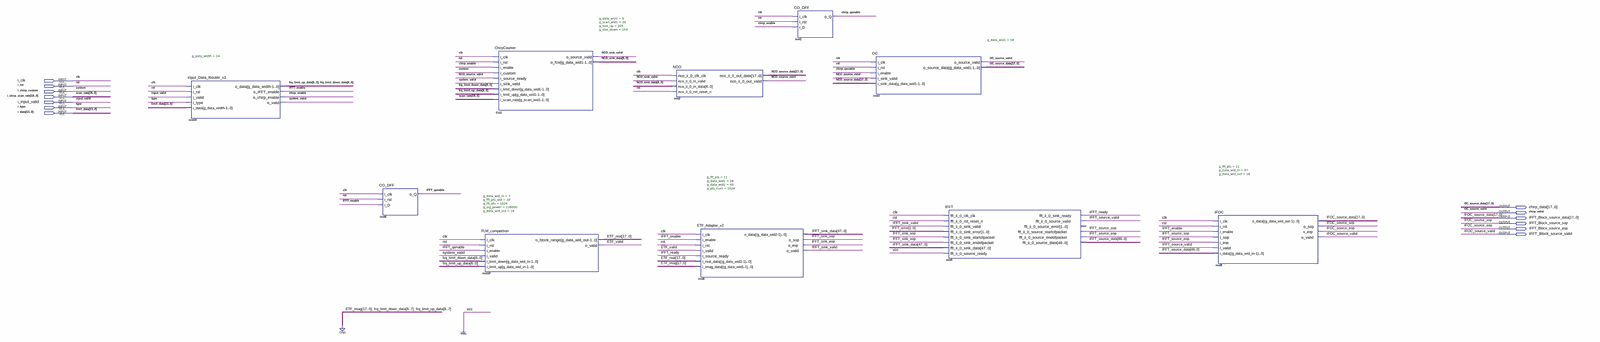
[diagram p0: schematic sheet, whole]
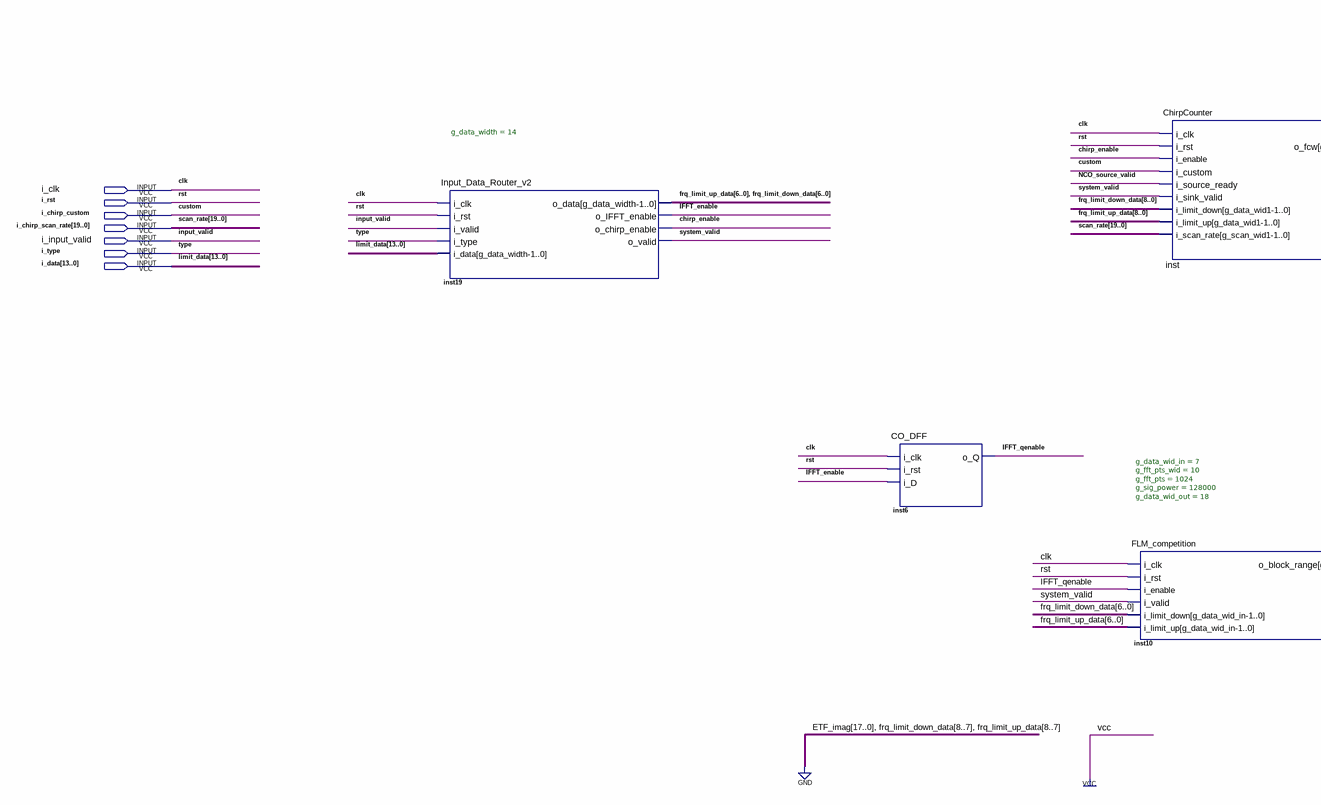
[diagram p1: schematic sheet, left part]
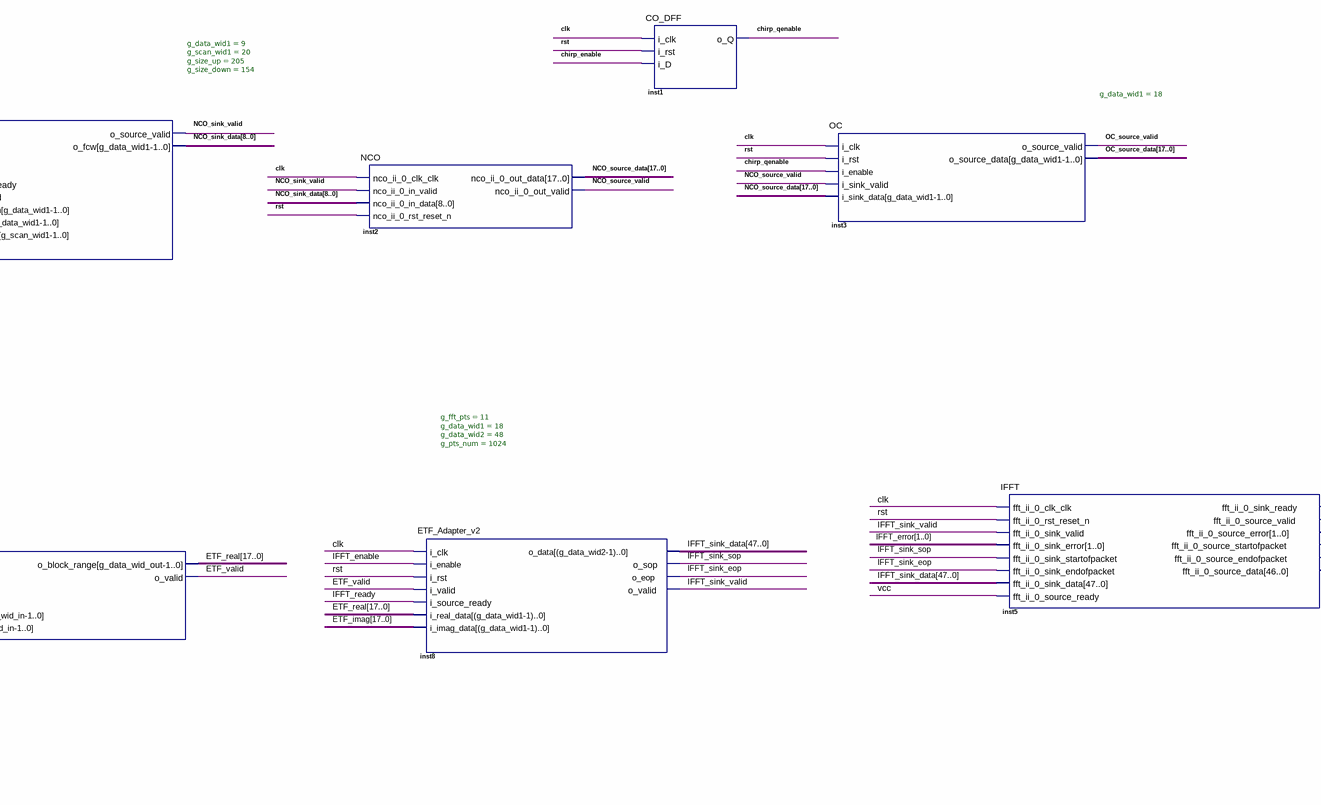
[diagram p2: schematic sheet, centre part]
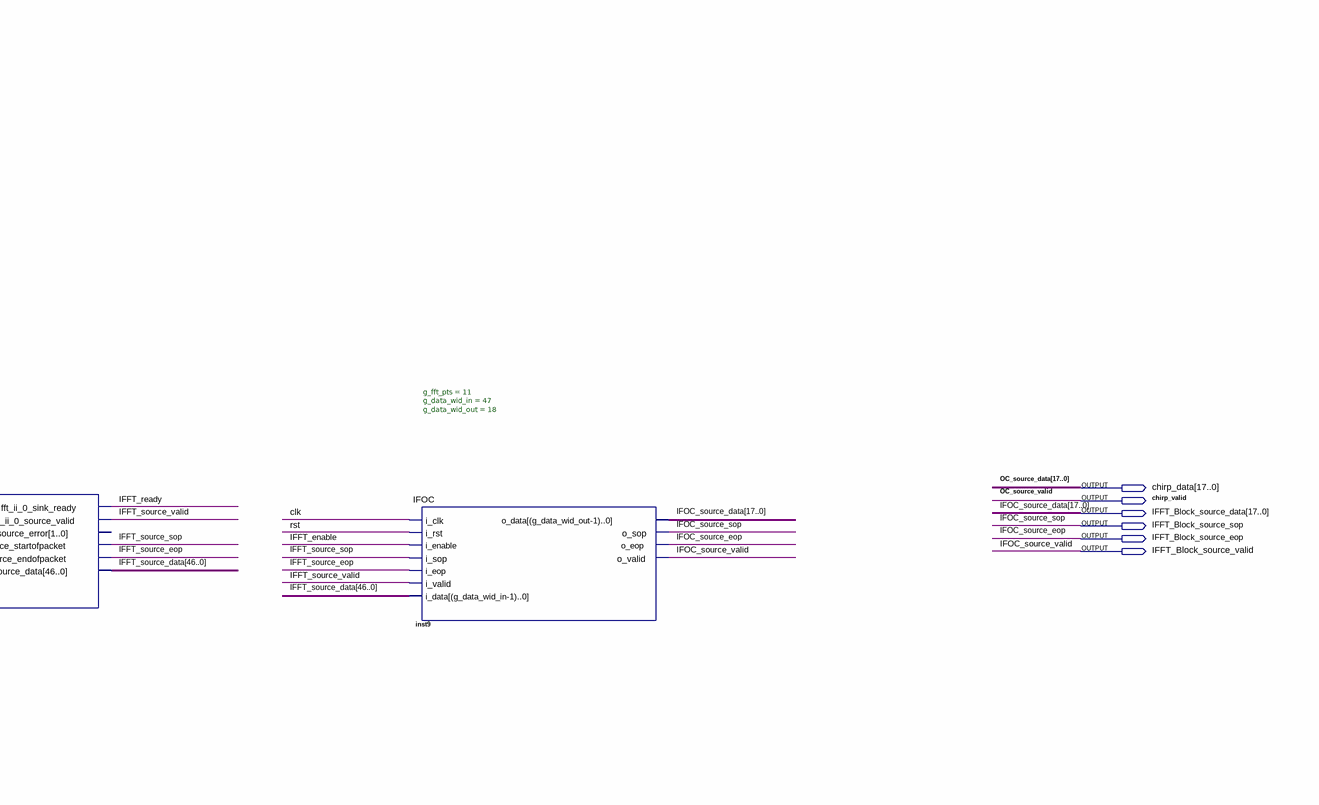
[diagram p3: schematic sheet, right part]
// Quartus schematic IFFT_Chirp_Test.bdf as structural Verilog: 10 symbols, 13 pins
module IFFT_Chirp_Test (
  input  i_clk,
  input  i_rst,
  input  i_chirp_custom,
  input  [19:0] i_chirp_scan_rate,
  input  i_input_valid,
  input  i_type,
  input  [13:0] i_data,
  output [17:0] chirp_data,
  output chirp_valid,
  output [17:0] IFFT_Block_source_data,
  output IFFT_Block_source_sop,
  output IFFT_Block_source_eop,
  output IFFT_Block_source_valid
);

  wire chirp_enable, chirp_qenable, ETF_valid, IFFT_enable, IFFT_qenable, IFFT_ready, IFFT_sink_eop,
       IFFT_sink_sop, IFFT_sink_valid, IFFT_source_eop, IFFT_source_sop, IFFT_source_valid, NCO_sink_valid,
       NCO_source_valid, system_valid;
  wire [1:0] IFFT_error;
  wire [6:0] frq_limit_down_data, frq_limit_up_data;
  wire [8:0] NCO_sink_data;
  wire [17:0] ETF_real, NCO_source_data;
  wire [46:0] IFFT_source_data;
  wire [47:0] IFFT_sink_data;

  Input_Data_Router_v2 #(.g_data_width(14)) inst19 (
    .i_clk(i_clk), .i_rst(i_rst), .i_valid(i_input_valid), .i_type(i_type), .i_data(i_data),
    .o_data({frq_limit_up_data, frq_limit_down_data}), .o_IFFT_enable(IFFT_enable),
    .o_chirp_enable(chirp_enable), .o_valid(system_valid));
  CO_DFF inst6 (.i_clk(i_clk), .i_rst(i_rst), .i_D(IFFT_enable), .o_Q(IFFT_qenable));
  ChirpCounter #(.g_data_wid1(9), .g_scan_wid1(20), .g_size_up(205), .g_size_down(154)) inst (
    .i_clk(i_clk), .i_rst(i_rst), .i_enable(chirp_enable), .i_custom(i_chirp_custom),
    .i_source_ready(NCO_source_valid), .i_sink_valid(system_valid),
    .i_limit_down({2'b00, frq_limit_down_data}), .i_limit_up({2'b00, frq_limit_up_data}),
    .i_scan_rate(i_chirp_scan_rate), .o_source_valid(NCO_sink_valid), .o_fcw(NCO_sink_data));
  FLM_competition #(.g_data_wid_in(7), .g_fft_pts_wid(10), .g_fft_pts(1024), .g_sig_power(128000), .g_data_wid_out(18)) inst10 (
    .i_clk(i_clk), .i_rst(i_rst), .i_enable(IFFT_qenable), .i_valid(system_valid),
    .i_limit_down(frq_limit_down_data), .i_limit_up(frq_limit_up_data), .o_block_range(ETF_real),
    .o_valid(ETF_valid));
  NCO inst2 (
    .nco_ii_0_clk_clk(i_clk), .nco_ii_0_in_valid(NCO_sink_valid), .nco_ii_0_in_data(NCO_sink_data),
    .nco_ii_0_rst_reset_n(i_rst), .nco_ii_0_out_data(NCO_source_data), .nco_ii_0_out_valid(NCO_source_valid));
  ETF_Adapter_v2 #(.g_fft_pts(11), .g_data_wid1(18), .g_data_wid2(48), .g_pts_num(1024)) inst8 (
    .i_clk(i_clk), .i_enable(IFFT_enable), .i_rst(i_rst), .i_valid(ETF_valid), .i_source_ready(IFFT_ready),
    .i_real_data(ETF_real), .i_imag_data({18{1'b0}}), .o_data(IFFT_sink_data), .o_sop(IFFT_sink_sop),
    .o_eop(IFFT_sink_eop), .o_valid(IFFT_sink_valid));
  CO_DFF inst1 (.i_clk(i_clk), .i_rst(i_rst), .i_D(chirp_enable), .o_Q(chirp_qenable));
  OC #(.g_data_wid1(18)) inst3 (
    .i_clk(i_clk), .i_rst(i_rst), .i_enable(chirp_qenable), .i_sink_valid(NCO_source_valid),
    .i_sink_data(NCO_source_data), .o_source_valid(chirp_valid), .o_source_data(chirp_data));
  IFFT inst5 (
    .fft_ii_0_clk_clk(i_clk), .fft_ii_0_rst_reset_n(i_rst), .fft_ii_0_sink_valid(IFFT_sink_valid),
    .fft_ii_0_sink_error(IFFT_error), .fft_ii_0_sink_startofpacket(IFFT_sink_sop),
    .fft_ii_0_sink_endofpacket(IFFT_sink_eop), .fft_ii_0_sink_data(IFFT_sink_data),
    .fft_ii_0_source_ready(1'b1), .fft_ii_0_sink_ready(IFFT_ready),
    .fft_ii_0_source_valid(IFFT_source_valid), .fft_ii_0_source_startofpacket(IFFT_source_sop),
    .fft_ii_0_source_endofpacket(IFFT_source_eop), .fft_ii_0_source_data(IFFT_source_data));  // open: fft_ii_0_source_error
  IFOC #(.g_fft_pts(11), .g_data_wid_in(47), .g_data_wid_out(18)) inst9 (
    .i_clk(i_clk), .i_rst(i_rst), .i_enable(IFFT_enable), .i_sop(IFFT_source_sop), .i_eop(IFFT_source_eop),
    .i_valid(IFFT_source_valid), .i_data(IFFT_source_data), .o_data(IFFT_Block_source_data),
    .o_sop(IFFT_Block_source_sop), .o_eop(IFFT_Block_source_eop), .o_valid(IFFT_Block_source_valid));

  // Other names for the same wires on the sheet: clk = i_clk; custom = i_chirp_custom;
  //   IFOC_source_data[17:0] = IFFT_Block_source_data; IFOC_source_eop = IFFT_Block_source_eop;
  //   IFOC_source_sop = IFFT_Block_source_sop; IFOC_source_valid = IFFT_Block_source_valid;
  //   input_valid = i_input_valid; limit_data[13:0] = i_data; OC_source_data[17:0] = chirp_data;
  //   OC_source_valid = chirp_valid; rst = i_rst; scan_rate[19:0] = i_chirp_scan_rate; type = i_type
endmodule
